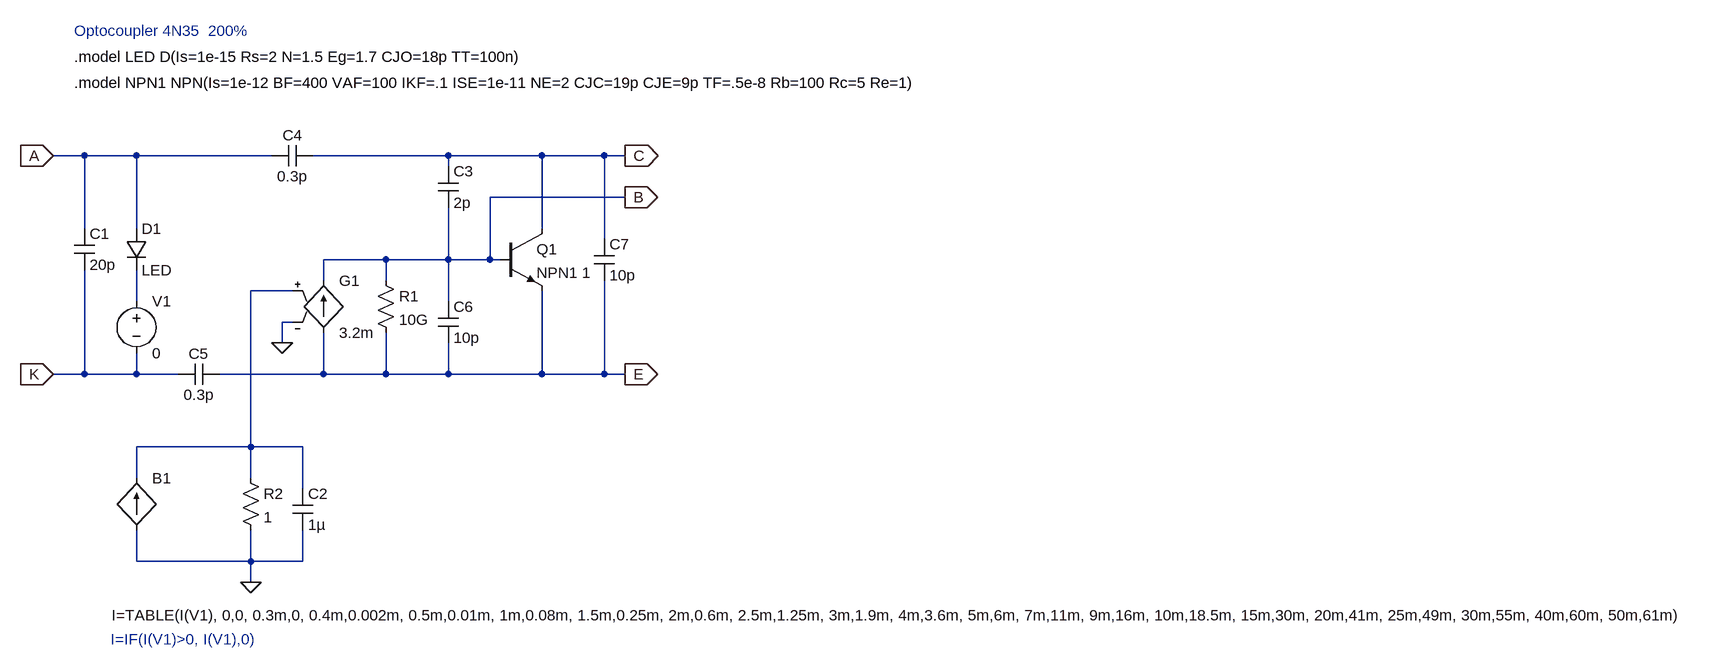
[diagram p0: schematic 4N35h.asc]
4N35h.asc, the LTspice schematic file:
Version 4
SHEET 1 2692 872
WIRE -96 112 -144 112
WIRE -16 112 -96 112
WIRE 192 112 -16 112
WIRE 464 112 256 112
WIRE 608 112 464 112
WIRE 704 112 608 112
WIRE 736 112 704 112
WIRE 464 128 464 112
WIRE 736 176 528 176
WIRE -96 224 -96 112
WIRE -16 224 -16 112
WIRE 608 224 608 112
WIRE 704 240 704 112
WIRE 368 272 272 272
WIRE 464 272 464 192
WIRE 464 272 368 272
WIRE 528 272 528 176
WIRE 528 272 464 272
WIRE 544 272 528 272
WIRE 272 304 272 272
WIRE 368 304 368 272
WIRE 224 320 160 320
WIRE -16 336 -16 288
WIRE 464 336 464 272
WIRE 224 368 208 368
WIRE 208 400 208 368
WIRE -96 448 -96 288
WIRE -96 448 -144 448
WIRE -16 448 -16 416
WIRE -16 448 -96 448
WIRE 48 448 -16 448
WIRE 272 448 272 384
WIRE 272 448 112 448
WIRE 368 448 368 384
WIRE 368 448 272 448
WIRE 464 448 464 400
WIRE 464 448 368 448
WIRE 608 448 608 320
WIRE 608 448 464 448
WIRE 704 448 704 304
WIRE 704 448 608 448
WIRE 736 448 704 448
WIRE 160 560 160 320
WIRE 160 560 -16 560
WIRE 240 560 160 560
WIRE -16 608 -16 560
WIRE 160 608 160 560
WIRE 240 624 240 560
WIRE -16 736 -16 688
WIRE 160 736 160 688
WIRE 160 736 -16 736
WIRE 240 736 240 688
WIRE 240 736 160 736
WIRE 160 768 160 736
FLAG -144 112 A
IOPIN -144 112 In
FLAG -144 448 K
IOPIN -144 448 In
FLAG 736 448 E
IOPIN 736 448 Out
FLAG 736 112 C
IOPIN 736 112 Out
FLAG 160 768 0
FLAG 208 400 0
FLAG 736 176 B
IOPIN 736 176 Out
SYMBOL diode -32 224 R0
SYMATTR InstName D1
SYMATTR Value LED
SYMBOL npn 544 224 R0
SYMATTR InstName Q1
SYMATTR Value NPN1 1
SYMBOL res 352 288 R0
SYMATTR InstName R1
SYMATTR Value 10G
SYMBOL cap -112 224 R0
SYMATTR InstName C1
SYMATTR Value 20p
SYMBOL voltage -16 320 R0
SYMATTR InstName V1
SYMATTR Value 0
SYMBOL res 144 592 R0
SYMATTR InstName R2
SYMATTR Value 1
SYMBOL cap 224 624 R0
SYMATTR InstName C2
SYMATTR Value 1µ
SYMBOL bi2 -16 608 R0
WINDOW 3 -38 211 Left 0
SYMATTR Value I=TABLE(I(V1), 0,0, 0.3m,0, 0.4m,0.002m, 0.5m,0.01m, 1m,0.08m, 1.5m,0.25m, 2m,0.6m, 2.5m,1.25m, 3m,1.9m, 4m,3.6m, 5m,6m, 7m,11m, 9m,16m, 10m,18.5m, 15m,30m, 20m,41m, 25m,49m, 30m,55m, 40m,60m, 50m,61m)
SYMATTR InstName B1
SYMBOL g 272 288 R0
SYMATTR InstName G1
SYMATTR Value 3.2m
SYMBOL cap 448 128 R0
SYMATTR InstName C3
SYMATTR Value 2p
SYMBOL cap 192 128 R270
WINDOW 0 32 32 VTop 0
WINDOW 3 0 32 VBottom 0
SYMATTR InstName C4
SYMATTR Value 0.3p
SYMBOL cap 48 464 R270
WINDOW 0 32 32 VTop 0
WINDOW 3 0 32 VBottom 0
SYMATTR InstName C5
SYMATTR Value 0.3p
SYMBOL cap 448 336 R0
SYMATTR InstName C6
SYMATTR Value 10p
SYMBOL cap 688 240 R0
SYMATTR InstName C7
SYMATTR Value 10p
TEXT -112 -40 Left 0 !.model LED D(Is=1e-15 Rs=2 N=1.5 Eg=1.7 CJO=18p TT=100n)
TEXT -112 -80 Left 0 ;Optocoupler 4N35  200%
TEXT -56 856 Left 0 ;I=IF(I(V1)>0, I(V1),0)
TEXT -112 0 Left 0 !.model NPN1 NPN(Is=1e-12 BF=400 VAF=100 IKF=.1 ISE=1e-11 NE=2 CJC=19p CJE=9p TF=.5e-8 Rb=100 Rc=5 Re=1)

The netlist it stands for:
* 4N35h.asc
D1 A N002 LED
Q1 C B E 0 NPN1 1
R1 B E 10G
C1 A K 20p
V1 N002 K 0
R2 N001 0 1
C2 N001 0 1µ
B1 0 N001 I=TABLE(I(V1), 0,0, 0.3m,0, 0.4m,0.002m, 0.5m,0.01m, 1m,0.08m, 1.5m,0.25m, 2m,0.6m, 2.5m,1.25m, 3m,1.9m, 4m,3.6m, 5m,6m, 7m,11m, 9m,16m, 10m,18.5m, 15m,30m, 20m,41m, 25m,49m, 30m,55m, 40m,60m, 50m,61m)
G1 E B N001 0 3.2m
C3 C B 2p
C4 A C 0.3p
C5 K E 0.3p
C6 B E 10p
C7 C E 10p
.model D D
.lib standard.dio
.model NPN NPN
.model PNP PNP
.lib standard.bjt
.model LED D(Is=1e-15 Rs=2 N=1.5 Eg=1.7 CJO=18p TT=100n)
* Optocoupler 4N35  200%
* I=IF(I(V1)>0, I(V1),0)
.model NPN1 NPN(Is=1e-12 BF=400 VAF=100 IKF=.1 ISE=1e-11 NE=2 CJC=19p CJE=9p TF=.5e-8 Rb=100 Rc=5 Re=1)
.backanno
.end